# Altium schematic sheet UsbC.SchDoc
size A
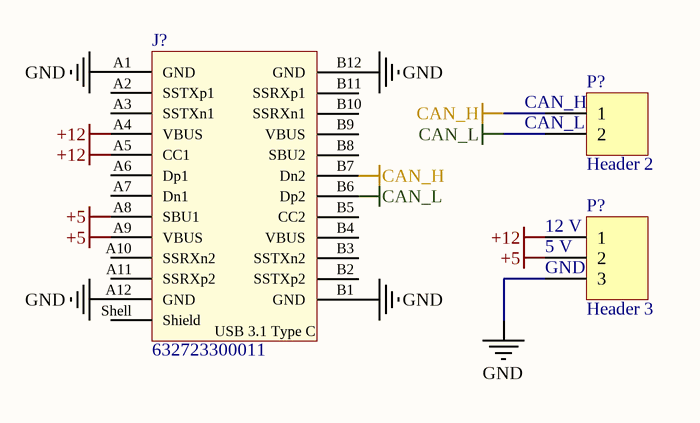
[diagram p0: UsbC.SchDoc]

## Parts
(Parts that share a designator on the sheet are numbered #1, #2 ... from top to bottom, then left to right.)
J?  632723300011  [632723300011]
P?#1  Header 2  [HDR1X2]
P?#2  Header 3  [HDR1X3]

## Nets
+5: J?.A8(SBU1) J?.A9(VBUS) P?#2.2
+12: J?.A4(VBUS) J?.A5(CC1) P?#2.1
CAN_H: J?.B7(Dn2) P?#1.1
CAN_L: J?.B6(Dp2) P?#1.2
GND: J?.A1(GND) J?.A12(GND) J?.B1(GND) J?.B12(GND) P?#2.3

Not connected (* = marked no-connect by the designer): J? A2(SSTXp1) A3(SSTXn1) A6(Dp1) A7(Dn1) A10(SSRXn2) A11(SSRXp2) B2(SSTXp2) B3(SSTXn2) B4(VBUS) B5(CC2) B8(SBU2) B9(VBUS) B10(SSRXn1) B11(SSRXp1) Shell(Shield)

## Notes on the sheet
- (near P?#1) CAN_H
- (near P?#1) CAN_L
- (near P?#2) 12 V
- (near P?#2) 5 V
- (near P?#2) GND
- (in symbol 632723300011) USB 3.1 Type C

## Library data of the parts
J? = 632723300011: USB 3.1 Type C Receptacle Horizontal THR WR-COM; Interface Type: Type C; Sub-Family: USB 3.1; ComponentLink1Description: Manufacturer; ComponentLink1URL: http://www.we-online.de; ComponentLink2Description: Datasheet; ComponentLink2URL: http://katalog.we-online.de/em/datasheet/632723x00011.pdf; Part Number: 632723300011; Published Date: April 2017; Publisher: Wurth Elektronik; Gender: Receptacle; Type: Horizontal; Construction: THR
P?#1 = Header 2: Header, 2-Pin; LatestRevisionDate: 17-Jul-2002; LatestRevisionNote: Re-released for DXP Platform.; Publisher: Altium Limited
P?#2 = Header 3: Header, 3-Pin; LatestRevisionDate: 17-Jul-2002; LatestRevisionNote: Re-released for DXP Platform.; Publisher: Altium Limited